# Altium schematic sheet CHM_CPU_FPGA_CLAMP.SchDoc: ASIM MXGS PSU Controller
size A4; Author: Andrzej Cichocki; Organization: Space Research Centre; Address1: Bartycka 18a; Address2: 00-716 Warsaw; Address3: Poland; Revision: 1; ModuleName: MainBoard Main; SubOrganization1: FPGA Space Applications Lab.
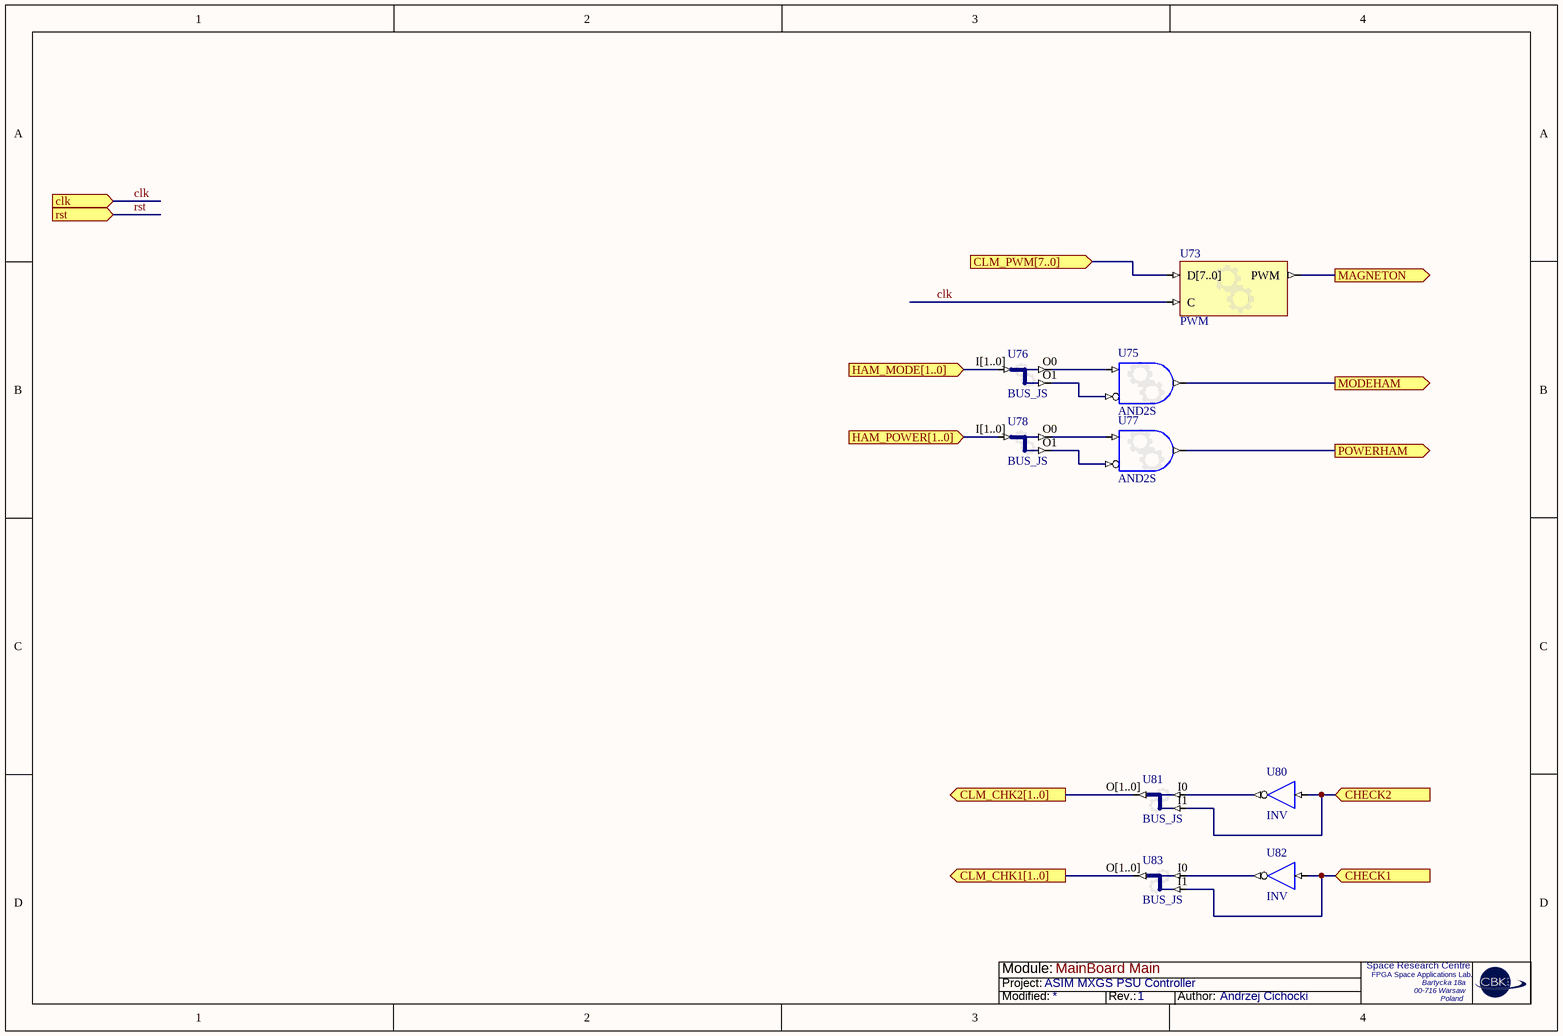
[diagram p0: CHM_CPU_FPGA_CLAMP.SchDoc]

## Parts
U73  PWM
U75  AND2S
U76  BUS_JS
U77  AND2S
U78  BUS_JS
U80  INV
U81  BUS_JS
U82  INV
U83  BUS_JS

## Ports
CHECK1 (in), CHECK2 (in), clk (in), CLM_CHK1[1..0] (out), CLM_CHK2[1..0] (out), CLM_PWM[7..0] (in), HAM_MODE[1..0] (in), HAM_POWER[1..0] (in), MAGNETON (out), MODEHAM (out), POWERHAM (out), rst (in)

## Nets
CHECK1: U82.I U83.I1 ; port CHECK1
CHECK2: U80.I U81.I1 ; port CHECK2
clk: U73.C ; port clk
CLM_CHK1[1..0]: U83.O[1..0] ; port CLM_CHK1[1..0]
CLM_CHK2[1..0]: U81.O[1..0] ; port CLM_CHK2[1..0]
CLM_PWM[7..0]: U73.D[7..0] ; port CLM_PWM[7..0]
HAM_MODE[1..0]: U76.I[1..0] ; port HAM_MODE[1..0]
HAM_POWER[1..0]: U78.I[1..0] ; port HAM_POWER[1..0]
MAGNETON: U73.PWM ; port MAGNETON
MODEHAM: U75.O ; port MODEHAM
POWERHAM: U77.O ; port POWERHAM
rst: port rst
NetU75_I0: U75.I0 U76.O0
NetU75_I1: U75.I1 U76.O1
NetU77_I0: U77.I0 U78.O0
NetU77_I1: U77.I1 U78.O1
NetU80_O: U80.O U81.I0
NetU82_O: U82.O U83.I0

## Notes on the sheet
- Module:
- Project:
- Modified:
- Rev.:
- Author:

## Library data of the parts
U73 = PWM: Configurable PWM; ConfiguratorName: GENERIC_PWM; ConfigurationParameters: {}Version[1.0]{}Width[8]{}Prescaler[1]{}; LastRevisionNo: 1.00.00; Published: 8-Apr-2009; Publisher: Altium Limited; HelpURL: https://wiki.altium.com/display/ADOH/New+Configurable+Generic+FPGA+Logic+Components
U75 U77 = GATE: Configurable Generic Gate; ConfiguratorName: GENERIC_GATE; ConfigurationParameters: {}Version[1.1]{}GateKind[AND]{}BusInput[False]{}GateInputType[Bit]{}GateOutputOption[Normal]{}BusWidth[8]{}RegisterOutputs[False]{}NegativeClockEdge[False]{}InputCount[2]{}InputInvert0[False]{}InputInvert1[True]{}; LastRevisionNo: 1.00.00; Published: 3-Sep-2008; Publisher: Altium Limited; HelpURL: https://wiki.altium.com/display/ADOH/Configurable+Generic+Library
U76 U78 = BUS_JS: Configurable Bus Joiner/Splitter; ConfiguratorName: GENERIC_BUS_JS; ConfigurationParameters: {}Version[1.1]{}SplitterJoinerType[Splitter]{}SignalCount[2]{}SignalWidth0[1]{}GapBelow0[1000000]{}ConnectionType0[Pin]{}SignalWidth1[1]{}GapBelow1[1000000]{}ConnectionType1[Pin]{}ShowPinNames[True]{}; LastRevisionNo: 1.00.00; Published: 17-Sep-2008; Publisher: Altium Limited; HelpURL: https://wiki.altium.com/display/ADOH/Configurable+Generic+Library
U80 U82 = INV: Inverter; FunctionalClass: Logic Primitive; ArchiveName: GENERIC; VHDLIB_SIM: GENERIC_LIB; Published: 29-Jan-2004; Publisher: Altium Limited; XilinxEquivalent: INV; LastRevisionNo: 1.00.00; HelpURL: CR0118 FPGA Generic Library Guide.pdf#page=291; ComponentLink1URL: CR0136 FPGA Logic Primitive Resource Usage.pdf#page=61; ComponentLink1Description: Core &Resource Usage; SubClass: INV
U81 U83 = BUS_JS: Configurable Bus Joiner/Splitter; ConfiguratorName: GENERIC_BUS_JS; ConfigurationParameters: {}Version[1.1]{}SplitterJoinerType[Joiner]{}SignalCount[2]{}SignalWidth0[1]{}GapBelow0[1000000]{}ConnectionType0[Pin]{}SignalWidth1[1]{}GapBelow1[1000000]{}ConnectionType1[Pin]{}ShowPinNames[True]{}; LastRevisionNo: 1.00.00; Published: 17-Sep-2008; Publisher: Altium Limited; HelpURL: https://wiki.altium.com/display/ADOH/Configurable+Generic+Library